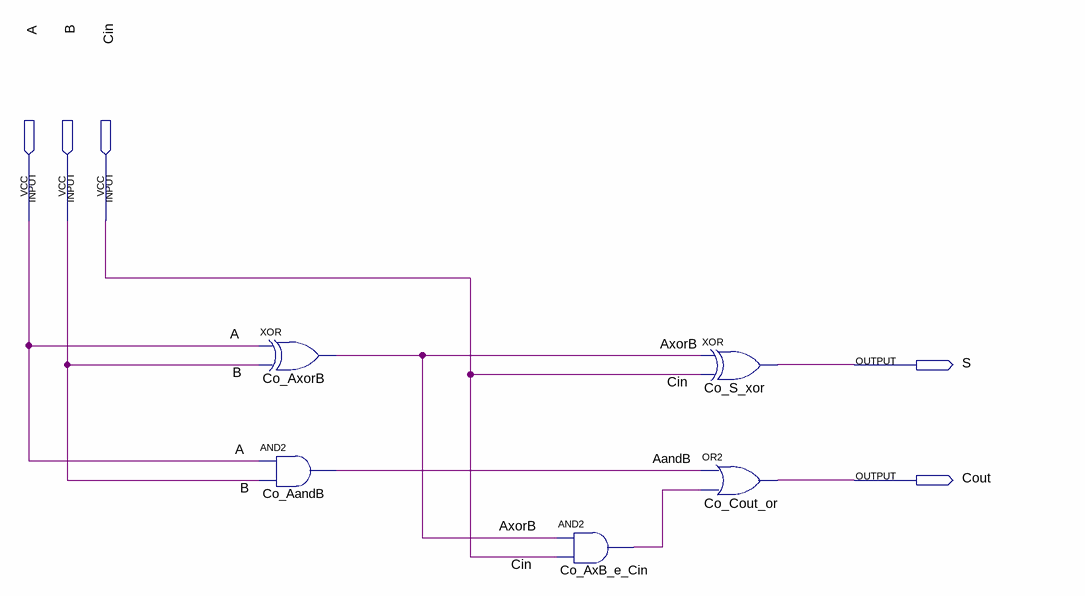
[diagram p0: schematic sheet]
// Quartus schematic FA.bdf as structural Verilog: 5 symbols, 5 pins
module FA (
  input  A,
  input  B,
  input  Cin,
  output S,
  output Cout
);

  wire AandB, AxorB, Co_AxB_e_Cin_out;

  xor Co_AxorB (AxorB, A, B);
  and Co_AandB (AandB, A, B);
  and Co_AxB_e_Cin (Co_AxB_e_Cin_out, AxorB, Cin);
  xor Co_S_xor (S, AxorB, Cin);
  or Co_Cout_or (Cout, AandB, Co_AxB_e_Cin_out);
endmodule
